# Altium schematic sheet MCU_Comparison.SchDoc: STM32F446 CNC
size B; Author: AM; CompanyName: Expatria Technologies; DrawnBy: A.Marles; Engineer: AM; Organization: Expatria Technologies; DocumentNumber: 3; SheetNumber: 3; SheetTotal: 14
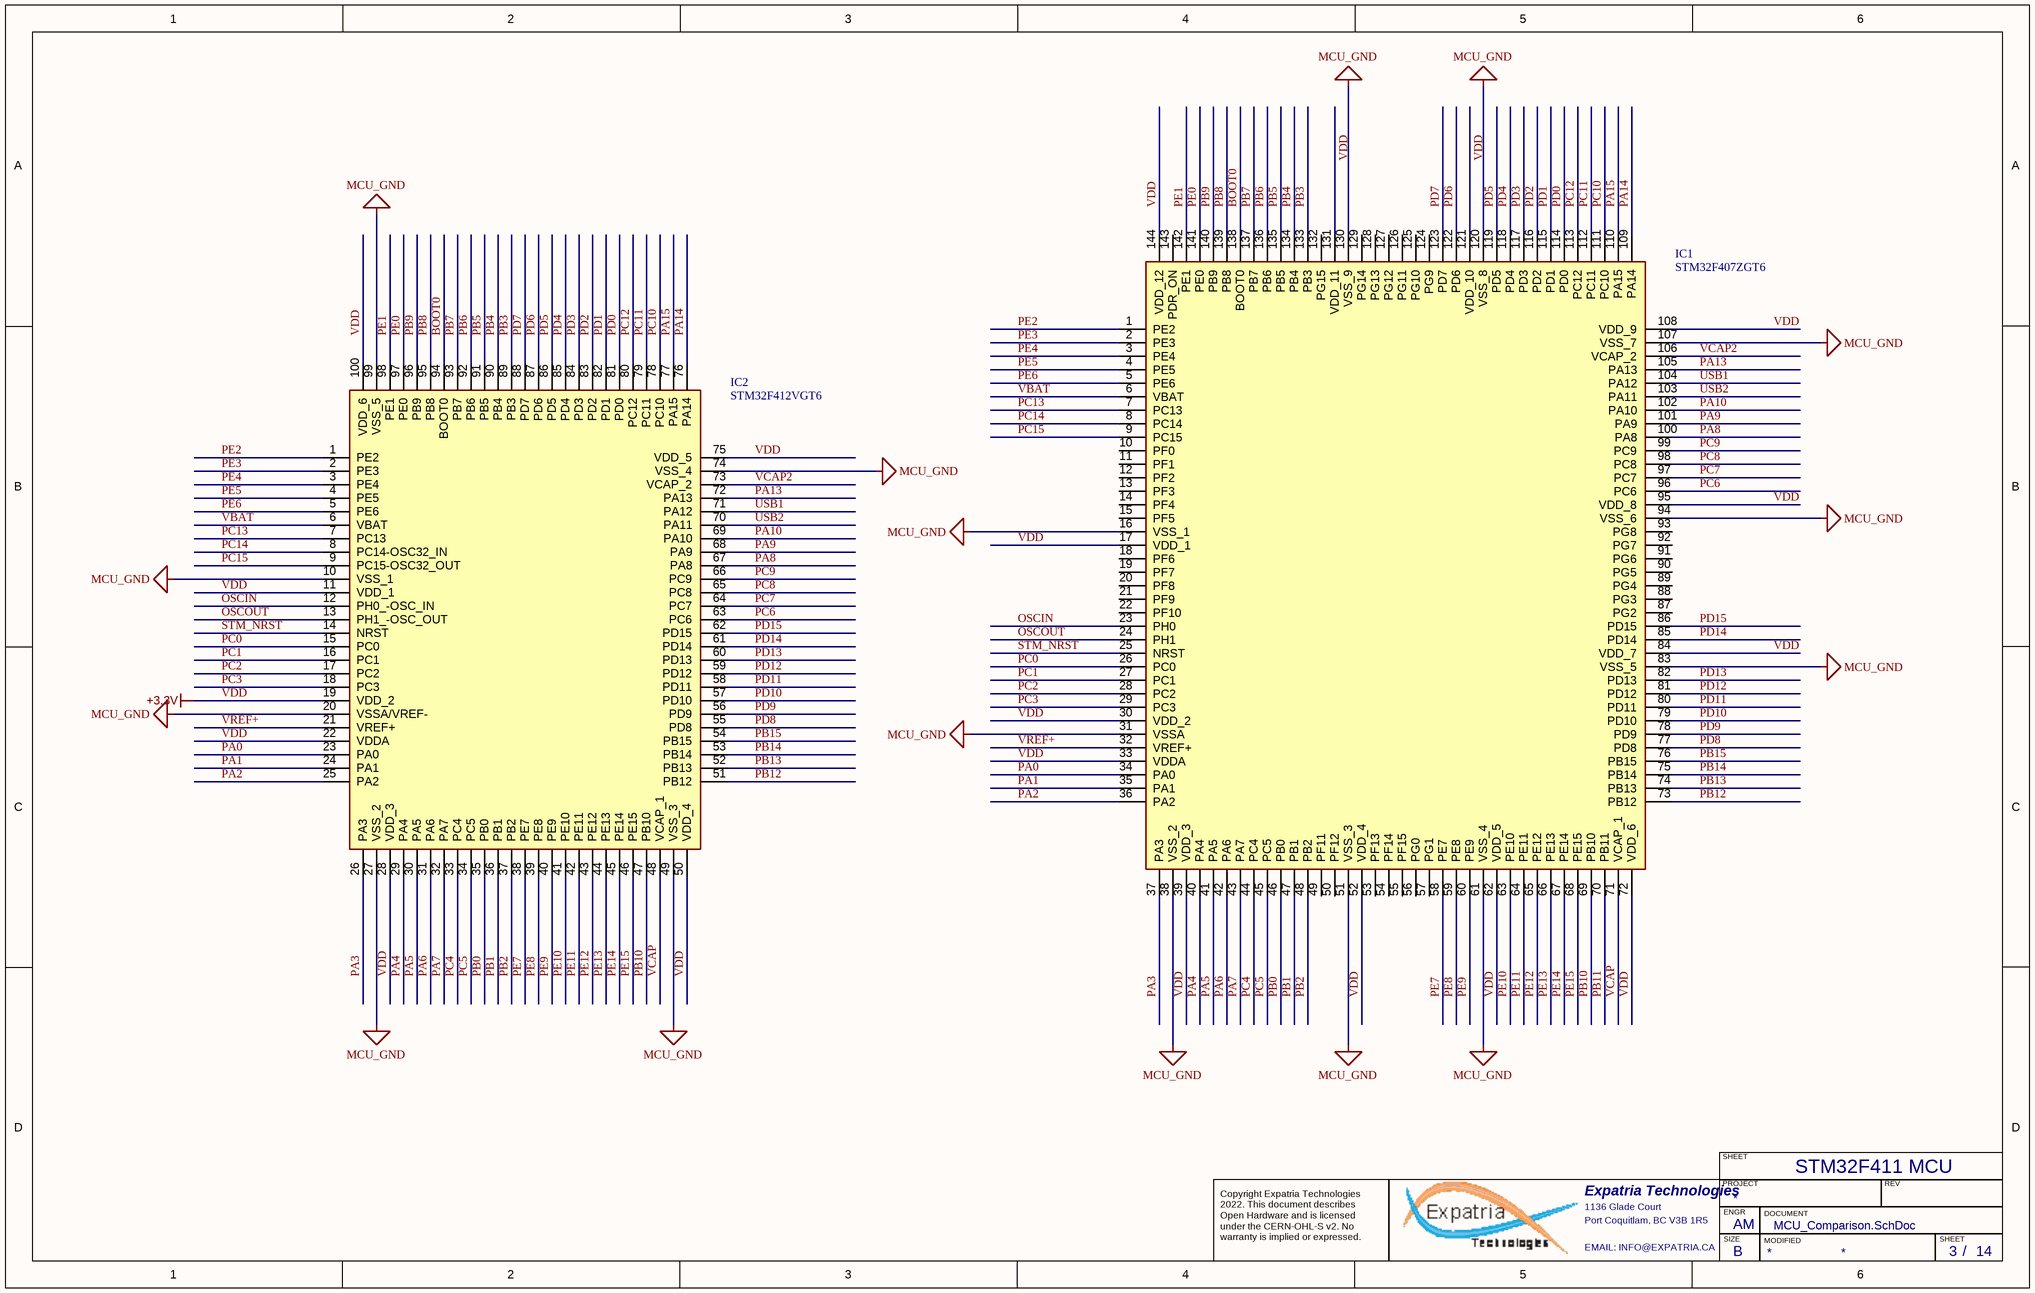
[diagram p0: MCU_Comparison.SchDoc]

## Parts
IC1  STM32F407ZGT6  [QFP50P2200X2200X160-144N]
IC2  STM32F412VGT6  [QFP50P1600X1600X160-100N]

## Nets
MCU_GND: IC1.16(VSS_1) IC1.31(VSSA) IC1.38(VSS_2) IC1.51(VSS_3) IC1.61(VSS_4) IC1.83(VSS_5) IC1.94(VSS_6) IC1.107(VSS_7) IC1.120(VSS_8) IC1.130(VSS_9) IC2.10(VSS_1) IC2.20(VSSA/VREF-) IC2.27(VSS_2) IC2.49(VSS_3) IC2.74(VSS_4) IC2.99(VSS_5)
VDD: IC1.17(VDD_1) IC1.30(VDD_2) IC1.33(VDDA) IC1.39(VDD_3) IC1.52(VDD_4) IC1.62(VDD_5) IC1.72(VDD_6) IC1.84(VDD_7) IC1.95(VDD_8) IC1.108(VDD_9) IC1.121(VDD_10) IC1.131(VDD_11) IC1.144(VDD_12) IC2.11(VDD_1) IC2.19(VDD_2) IC2.22(VDDA) IC2.28(VDD_3) IC2.50(VDD_4) IC2.75(VDD_5) IC2.100(VDD_6)  [also labelled +3.3V]
BOOT0: IC1.138(BOOT0) IC2.94(BOOT0)
OSCIN: IC1.23(PH0) IC2.12(PH0_-OSC_IN)
OSCOUT: IC1.24(PH1) IC2.13(PH1_-OSC_OUT)
PA0: IC1.34(PA0) IC2.23(PA0)
PA1: IC1.35(PA1) IC2.24(PA1)
PA2: IC1.36(PA2) IC2.25(PA2)
PA3: IC1.37(PA3) IC2.26(PA3)
PA4: IC1.40(PA4) IC2.29(PA4)
PA5: IC1.41(PA5) IC2.30(PA5)
PA6: IC1.42(PA6) IC2.31(PA6)
PA7: IC1.43(PA7) IC2.32(PA7)
PA8: IC1.100(PA8) IC2.67(PA8)
PA9: IC1.101(PA9) IC2.68(PA9)
PA10: IC1.102(PA10) IC2.69(PA10)
PA13: IC1.105(PA13) IC2.72(PA13)
PA14: IC1.109(PA14) IC2.76(PA14)
PA15: IC1.110(PA15) IC2.77(PA15)
PB0: IC1.46(PB0) IC2.35(PB0)
PB1: IC1.47(PB1) IC2.36(PB1)
PB2: IC1.48(PB2) IC2.37(PB2)
PB3: IC1.133(PB3) IC2.89(PB3)
PB4: IC1.134(PB4) IC2.90(PB4)
PB5: IC1.135(PB5) IC2.91(PB5)
PB6: IC1.136(PB6) IC2.92(PB6)
PB7: IC1.137(PB7) IC2.93(PB7)
PB8: IC1.139(PB8) IC2.95(PB8)
PB9: IC1.140(PB9) IC2.96(PB9)
PB10: IC1.69(PB10) IC2.47(PB10)
PB11: IC1.70(PB11)
PB12: IC1.73(PB12) IC2.51(PB12)
PB13: IC1.74(PB13) IC2.52(PB13)
PB14: IC1.75(PB14) IC2.53(PB14)
PB15: IC1.76(PB15) IC2.54(PB15)
PC0: IC1.26(PC0) IC2.15(PC0)
PC1: IC1.27(PC1) IC2.16(PC1)
PC2: IC1.28(PC2) IC2.17(PC2)
PC3: IC1.29(PC3) IC2.18(PC3)
PC4: IC1.44(PC4) IC2.33(PC4)
PC5: IC1.45(PC5) IC2.34(PC5)
PC6: IC1.96(PC6) IC2.63(PC6)
PC7: IC1.97(PC7) IC2.64(PC7)
PC8: IC1.98(PC8) IC2.65(PC8)
PC9: IC1.99(PC9) IC2.66(PC9)
PC10: IC1.111(PC10) IC2.78(PC10)
PC11: IC1.112(PC11) IC2.79(PC11)
PC12: IC1.113(PC12) IC2.80(PC12)
PC13: IC1.7(PC13) IC2.7(PC13)
PC14: IC1.8(PC14) IC2.8(PC14-OSC32_IN)
PC15: IC1.9(PC15) IC2.9(PC15-OSC32_OUT)
PD0: IC1.114(PD0) IC2.81(PD0)
PD1: IC1.115(PD1) IC2.82(PD1)
PD2: IC1.116(PD2) IC2.83(PD2)
PD3: IC1.117(PD3) IC2.84(PD3)
PD4: IC1.118(PD4) IC2.85(PD4)
PD5: IC1.119(PD5) IC2.86(PD5)
PD6: IC1.122(PD6) IC2.87(PD6)
PD7: IC1.123(PD7) IC2.88(PD7)
PD8: IC1.77(PD8) IC2.55(PD8)
PD9: IC1.78(PD9) IC2.56(PD9)
PD10: IC1.79(PD10) IC2.57(PD10)
PD11: IC1.80(PD11) IC2.58(PD11)
PD12: IC1.81(PD12) IC2.59(PD12)
PD13: IC1.82(PD13) IC2.60(PD13)
PD14: IC1.85(PD14) IC2.61(PD14)
PD15: IC1.86(PD15) IC2.62(PD15)
PE0: IC1.141(PE0) IC2.97(PE0)
PE1: IC1.142(PE1) IC2.98(PE1)
PE2: IC1.1(PE2) IC2.1(PE2)
PE3: IC1.2(PE3) IC2.2(PE3)
PE4: IC1.3(PE4) IC2.3(PE4)
PE5: IC1.4(PE5) IC2.4(PE5)
PE6: IC1.5(PE6) IC2.5(PE6)
PE7: IC1.58(PE7) IC2.38(PE7)
PE8: IC1.59(PE8) IC2.39(PE8)
PE9: IC1.60(PE9) IC2.40(PE9)
PE10: IC1.63(PE10) IC2.41(PE10)
PE11: IC1.64(PE11) IC2.42(PE11)
PE12: IC1.65(PE12) IC2.43(PE12)
PE13: IC1.66(PE13) IC2.44(PE13)
PE14: IC1.67(PE14) IC2.45(PE14)
PE15: IC1.68(PE15) IC2.46(PE15)
STM_NRST: IC1.25(NRST) IC2.14(NRST)
USB1: IC1.104(PA12) IC2.71(PA12)
USB2: IC1.103(PA11) IC2.70(PA11)
VBAT: IC1.6(VBAT) IC2.6(VBAT)
VCAP: IC1.71(VCAP_1) IC2.48(VCAP_1)
VCAP2: IC1.106(VCAP_2) IC2.73(VCAP_2)
VREF+: IC1.32(VREF+) IC2.21(VREF+)

Not connected (* = marked no-connect by the designer): IC1 10(PF0) 11(PF1) 12(PF2) 13(PF3) 14(PF4) 15(PF5) 18(PF6) 19(PF7) 20(PF8) 21(PF9) 22(PF10) 49(PF11) 50(PF12) 53(PF13) 54(PF14) 55(PF15) 56(PG0) 57(PG1) 87(PG2) 88(PG3) 89(PG4) 90(PG5) 91(PG6) 92(PG7) 93(PG8) 124(PG9) 125(PG10) 126(PG11) 127(PG12) 128(PG13) 129(PG14) 132(PG15) 143(PDR_ON)

## Notes on the sheet
- STM32F411 MCU
- SHEET
- Expatria Technologies
- 1136 Glade Court
- Port Coquitlam, BC V3B 1R5
- PROJECT
- SIZE
- ENGR
- MODIFIED
- DOCUMENT
- REV
- Copyright Expatria Technologies 2022. This document describes Open Hardware and is licensed under the CERN-OHL-S v2. No warranty is implied or expressed.
- EMAIL: INFO@EXPATRIA.CA
- B
- /

## Library data of the parts
IC1 = STM32F407ZGT6: Integrated Circuit; Manufacturer_Name: STMicroelectronics; Datasheet Link: http://www.st.com/web/en/resource/technical/document/datasheet/DM00037051.pdf; Height: 1.6mm; Manufacturer_Part_Number: STM32F407ZGT6; Mouser Part Number: 511-STM32F407ZGT6; Mouser Price/Stock: https://www.mouser.co.uk/ProductDetail/STMicroelectronics/STM32F407ZGT6?qs=Z8%252BeY1k3TIKo142SZNWnSQ%3D%3D; Arrow Part Number: STM32F407ZGT6; Arrow Price/Stock: https://www.arrow.com/en/products/stm32f407zgt6/stmicroelectronics?region=nac
IC2 = STM32F412VGT6: Integrated Circuit; Manufacturer_Name: STMicroelectronics; Datasheet Link: https://4donline.ihs.com/images/VipMasterIC/IC/SGST/SGST-S-A0004202317/SGST-S-A0004202317-1.pdf?hkey=6D3A4C79FDBF58556ACFDE234799DDF0; Height: 1.6mm; Manufacturer_Part_Number: STM32F412VGT6; Mouser Part Number: 511-STM32F412VGT6; Mouser Price/Stock: https://www.mouser.co.uk/ProductDetail/STMicroelectronics/STM32F412VGT6/?qs=qzCNEk%252BRr%252BaGf9Ry5zWpvw%3D%3D; Arrow Part Number: STM32F412VGT6; Arrow Price/Stock: https://www.arrow.com/en/products/stm32f412vgt6/stmicroelectronics